# EAGLE schematic CANSniffer_v28 (EAGLE 9.7.0)
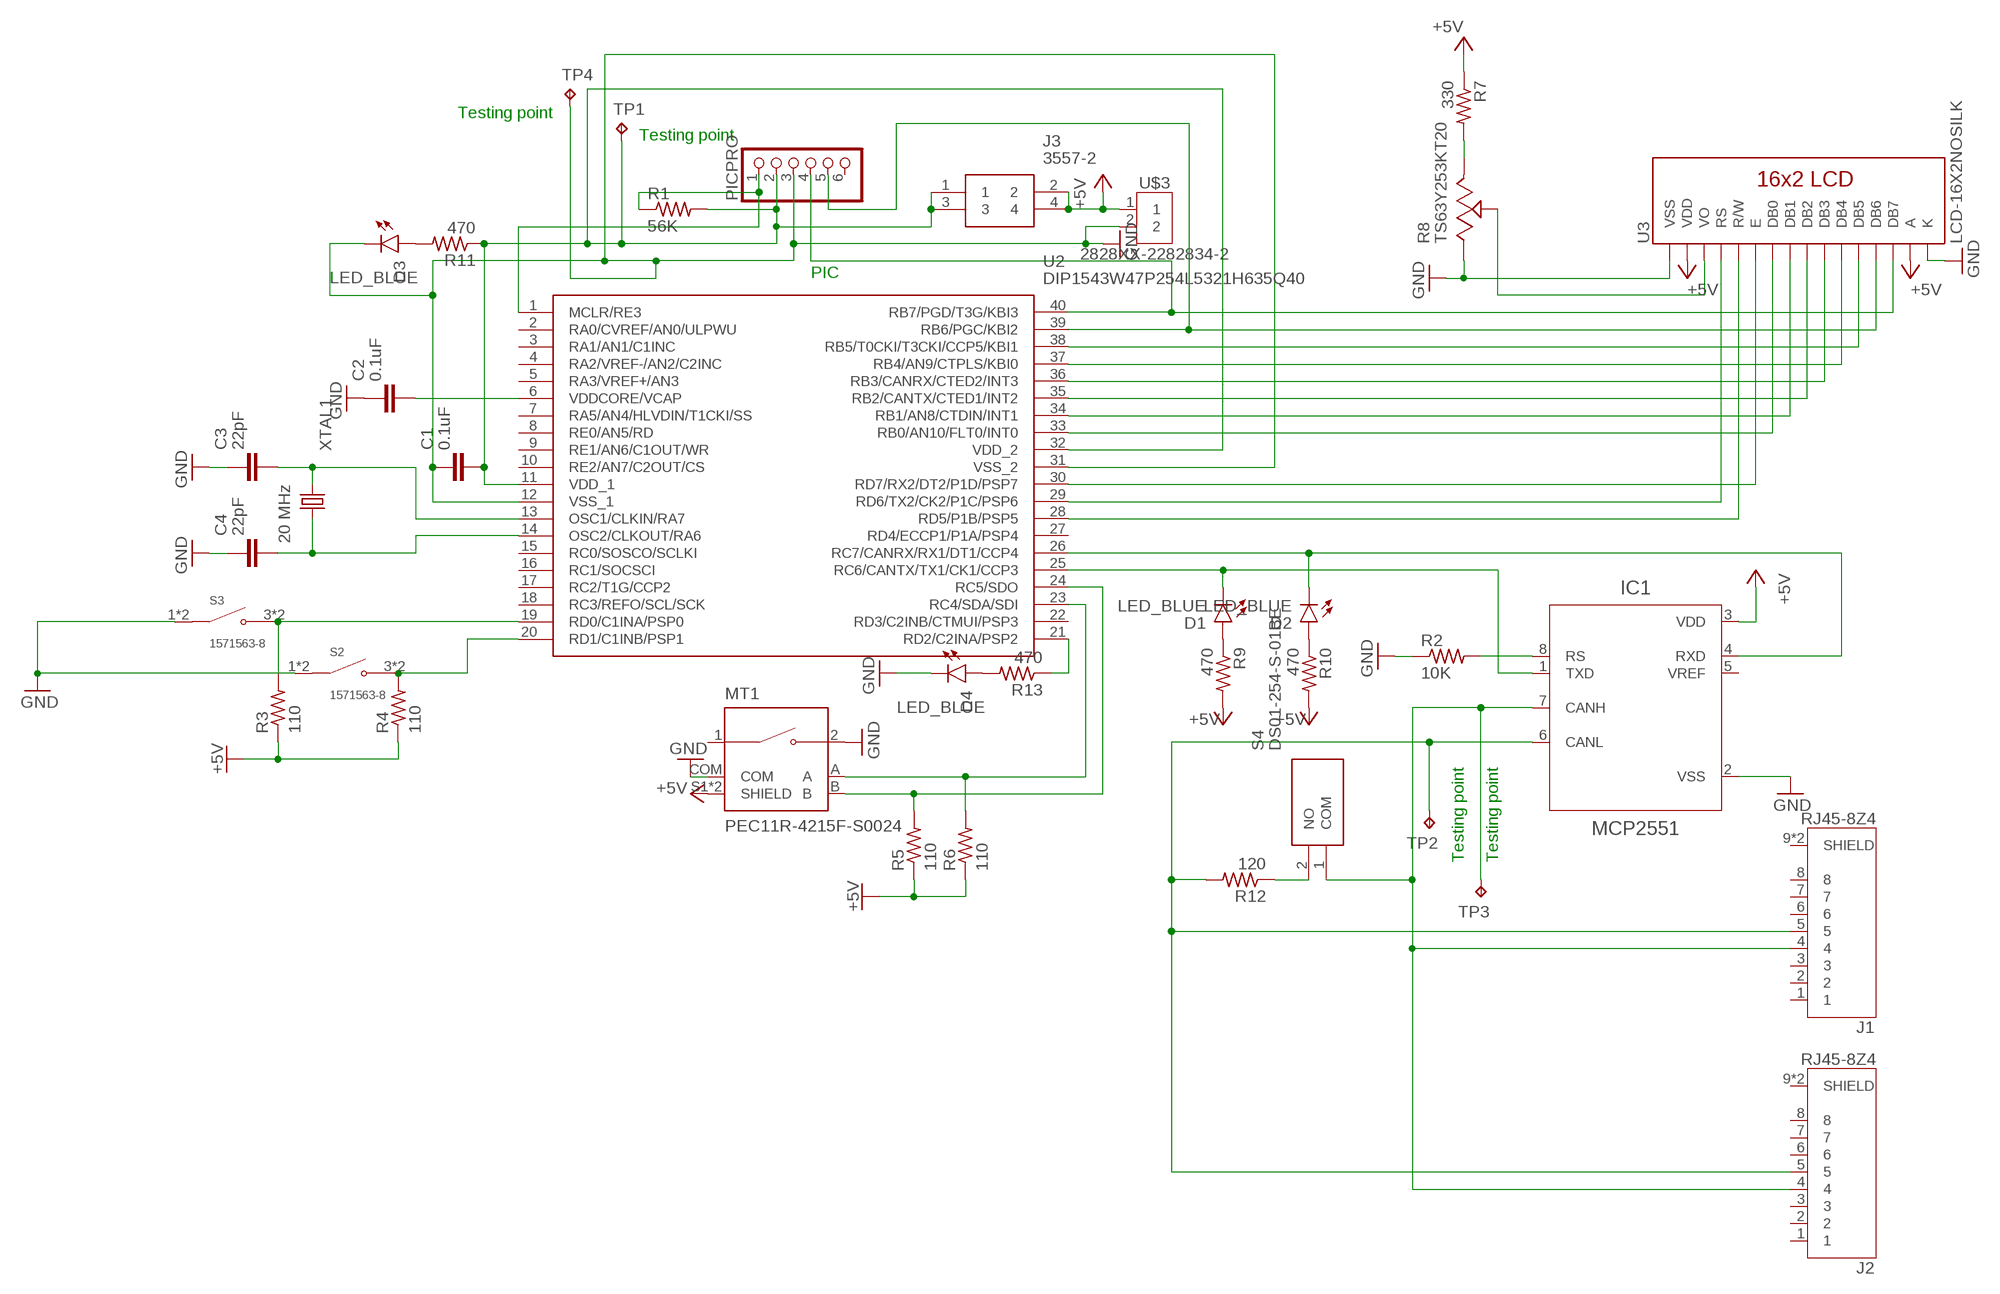
[diagram p0: schematic, sheet 1]

## Parts
C1  0.1uF  C_CHIP-1206(3216-METRIC)  [CAPC3216X135]
C2  0.1uF  C_CHIP-1206(3216-METRIC)  [CAPC3216X135]
C3  22pF  C_CHIP-1206(3216-METRIC)  [CAPC3216X135]
C4  22pF  C_CHIP-1206(3216-METRIC)  [CAPC3216X135]
D1  LED_BLUE  CHIP-FLAT-B_0402  [LEDC1005X25N_FLAT-B]
D2  LED_BLUE  CHIP-FLAT-B_0402  [LEDC1005X25N_FLAT-B]
D3  LED_BLUE  CHIP-FLAT-B_0402  [LEDC1005X25N_FLAT-B]
D4  LED_BLUE  CHIP-FLAT-B_0402  [LEDC1005X25N_FLAT-B]
IC1  MCP2551  MCP2551-I/SN_PDIP  [DIP1092W55P254L949H533Q8B]
J1  RJ45-8Z4  [TE_RJ45-8Z4]
J2  RJ45-8Z4  [TE_RJ45-8Z4]
J3  3557-2  [3557-2]
MT1  PEC11R-4215F-S0024  [XDCR_PEC11R-4215F-S0024]
PICPRO  PINHD-1X6  [1X06]
R1  56K  R-US_R0603  [R0603]
R2  10K  R-US_R0603  [R0603]
R3  110  R-US_R0603  [R0603]
R4  110  R-US_R0603  [R0603]
R5  110  R-US_R0603  [R0603]
R6  110  R-US_R0603  [R0603]
R7  330  R-US_R0603  [R0603]
R8  TS63Y253KT20  [TRIM_TS63Y253KT20]
R9  470  R-US_R0603  [R0603]
R10  470  R-US_R0603  [R0603]
R11  470  R-US_R0603  [R0603]
R12  120  R-US_R0603  [R0603]
R13  470  R-US_R0603  [R0603]
S2  1571563-8  [SW_1571563-8]
S3  1571563-8  [SW_1571563-8]
S4  DS01-254-S-01BE  [DS01254S01BE]
TP1  TPTP16R  [TP16R]
TP2  TPTP16R  [TP16R]
TP3  TPTP16R  [TP16R]
TP4  TPTP16R  [TP16R]
U2  DIP1543W47P254L5321H635Q40  [DIP1543W47P254L5321H635Q40]
U3  LCD-16X2NOSILK  [LCD-16X2_NOSILK]
U$3  2828XX-2282834-2  [TERMBLK_254-2N]
XTAL1  20 MHz  CRYSTAL_HC49-11.5L  [XTALRR488W45L1150T500H350B]

## Nets
+5V: IC1.3(VDD) J3.2 J3.4 MT1.S1(SHIELD) MT1.S2(SHIELD) R3.1 R4.1 R5.1 R6.1 R7.1 R9.2 R10.2 U3.2(VDD) U3.15(A) U$3.1
GND [12V]: C1.1 C2.1 C3.1 C4.1 D3.C D4.C IC1.2(VSS) MT1.2 MT1.COM PICPRO.3 R2.1 S2.1(COM) S2.2(COM) S3.1(COM) S3.2(COM) TP4.TP U2.12(VSS_1) U2.31(VSS_2) U3.16(K) U$3.2
N$1: PICPRO.1 R1.1 U2.1(MCLR/RE3)
N$2: U2.33(RB0/AN10/FLT0/INT0) U3.7(DB0)
N$3: IC1.8(RS) R2.2
N$4: D1.C IC1.1(TXD) U2.25(RC6/CANTX/TX1/CK1/CCP3)
N$5: PICPRO.4 U2.40(RB7/PGD/T3G/KBI3) U3.14(DB7)
N$6: PICPRO.5 U2.39(RB6/PGC/KBI2) U3.13(DB6)
N$7: U2.34(RB1/AN8/CTDIN/INT1) U3.8(DB1)
N$8: U2.35(RB2/CANTX/CTED1/INT2) U3.9(DB2)
N$9: D2.C IC1.4(RXD) U2.26(RC7/CANRX/RX1/DT1/CCP4)
N$10: C3.2 U2.13(OSC1/CLKIN/RA7) XTAL1.1
N$11: C4.2 U2.14(OSC2/CLKOUT/RA6) XTAL1.2
N$12: IC1.6(CANL) J1.5 J2.5 R12.2 TP2.TP
N$13: IC1.7(CANH) J1.4 J2.4 S4.1(COM) TP3.TP
N$14: U2.36(RB3/CANRX/CTED2/INT3) U3.10(DB3)
N$15: U2.37(RB4/AN9/CTPLS/KBI0) U3.11(DB4)
N$16: U2.38(RB5/T0CKI/T3CKI/CCP5/KBI1) U3.12(DB5)
N$17: U2.28(RD5/P1B/PSP5) U3.5(R/W)
N$18: U2.29(RD6/TX2/CK2/P1C/PSP6) U3.4(RS)
N$19: U2.30(RD7/RX2/DT2/P1D/PSP7) U3.6(E)
N$20: D2.A R10.1
N$21: R7.2 R8.3(C)
N$22: R3.2 S3.3(NO) S3.4(NO) U2.19(RD0/C1INA/PSP0)
N$23: R4.2 S2.3(NO) S2.4(NO) U2.20(RD1/C1INB/PSP1)
N$24: C2.2 U2.6(VDDCORE/VCAP)
N$25: MT1.A R6.2 U2.23(RC4/SDA/SDI)
N$26: MT1.B R5.2 U2.24(RC5/SDO)
N$27: R8.2(B) U3.3(VO)
N$28: D1.A R9.1
N$29: R12.1 S4.2(NO)
N$30: C1.2 J3.1 J3.3 PICPRO.2 R1.2 R11.1 TP1.TP U2.11(VDD_1) U2.32(VDD_2)
N$31 [12V]: R8.1(A) U3.1(VSS) ; supply symbol labelled GND
N$32: D3.A R11.2
N$33: D4.A R13.2
N$34: R13.1 U2.21(RD2/C2INA/PSP2)
Unconnected: IC1.5(VREF) J1.1 J1.2 J1.3 J1.6 J1.7 J1.8 J1.9(SHIELD) J1.10(SHIELD) J2.1 J2.2 J2.3 J2.6 J2.7 J2.8 J2.9(SHIELD) J2.10(SHIELD) MT1.1 PICPRO.6 U2.2(RA0/CVREF/AN0/ULPWU) U2.3(RA1/AN1/C1INC) U2.4(RA2/VREF-/AN2/C2INC) U2.5(RA3/VREF+/AN3) U2.7(RA5/AN4/HLVDIN/T1CKI/SS) U2.8(RE0/AN5/RD) U2.9(RE1/AN6/C1OUT/WR) U2.10(RE2/AN7/C2OUT/CS) U2.15(RC0/SOSCO/SCLKI) U2.16(RC1/SOCSCI) U2.17(RC2/T1G/CCP2) U2.18(RC3/REFO/SCL/SCK) U2.22(RD3/C2INB/CTMUI/PSP3) U2.27(RD4/ECCP1/P1A/PSP4)

## Notes on the sheet
- Testing point
- Testing point
- PIC
- Testing point | Testing point

## Library data of the parts
C1-C4 = Capacitor:C: Capacitor - Generic; CATEGORY: Capacitor
D1-D4 = LED:CHIP-FLAT-B; CATEGORY: LED; COLOR: BLUE; DESCRIPTION: CHIP LED FLAT; SUB-CATEGORY: CHIP; TYPE: FLAT_TOP
IC1 = IC_Interface:MCP2551-I/SN: High - Speed CAN Transceiver Datasheet <http://ww1.microchip.com/downloads/en/devicedoc/20001667g.pdf>; CATEGORY: RF_Wireless; MANUFACTURER: Microchip; MPN: MCP2551-I/SN; OPERATING_TEMP: -40 to +85 °C; PART_STATUS: Active; ROHS_COMPLIANT: RoHS3 Compliant; SUB-CATEGORY: Transceiver
J1 J2 = RJ45-8Z4:RJ45-8Z4: CONN MOD JACK 8P8C R/A SHIELDED; AVAILABILITY: Good; DESCRIPTION: RJ Jack / Signal Line EMI/RFI Filters 8 TRM NO FLTR LOWPRO BRD GRND&CBL; GRND; MF: TE; MP: RJ45-8Z4; PACKAGE: None; PRICE: 4.35 USD; STANDARD: Manufacturer Recommendation
J3 = 3557-2:3557-2: THM 2 in 1 Auto Blade Holder P/N 3557-2 Source: Datasheet <http://www.keyelco.com/product-pdf.cfm?p=296>; DESCRIPTION: THM 2 in 1 Auto Blade Holder P/N 3557-2; HEIGHT: mm; MANUFACTURER_NAME: Keystone Electronics; MANUFACTURER_PART_NUMBER: 3557-2; MOUSER_PART_NUMBER: 534-3557-2; MOUSER_PRICE-STOCK: https://www.mouser.co.uk/ProductDetail/Keystone-Electronics/3557-2?qs=cxy41lVAGV%2FfbyASjpXK1g%3D%3D
MT1 = PEC11R-4215F-S0024 (1):PEC11R-4215F-S0024: Incremental Encoder, 12 Mm, Contact Rating 10 Ma - 5 Vdc; MANUFACTURER: J.W.Miller/Bourns; MAXIMUM_PACKAGE_HEIGHT: 21.5 mm; PARTREV: Rev. 09/19; STANDARD: Manufacturer Recommendations
PICPRO = adafruit:PINHD-1X6: PIN HEADER
R1-R7 R9-R13 = adafruit:R-US_: RESISTOR, American symbol
R8 = TS63Y253KT20:TS63Y253KT20; MANUFACTURER: Vishay; MAXIMUM_PACKAGE_HEIGHT: 8 mm; PARTREV: 17-Oct-2018; SNAPEDA_PN: TS63Y253KT20; STANDARD: Manufacturer Recommendations
S2 S3 = 1571563-8:1571563-8; COMMENT: 1571563-8; EU_ROHS_COMPLIANCE: Compliant
S4 = Switch:DS01-254-S-01BE: DIP Switches / SIP Switches DIP Switch, SPST, 2.54 pitch, raised actuator, flat bottom, Short pin, 1 position, Blue Source: Datasheet <https://www.mouser.in/datasheet/2/670/ds01_254-1777712.pdf>; ARROW_PART_NUMBER: DS01-254-S-01BE; ARROW_PRICE-STOCK: https://www.arrow.com/en/products/ds01-254-s-01be/cui-devices?region=nac; DESCRIPTION: DIP Switches / SIP Switches DIP Switch, SPST, 2.54 pitch, raised actuator, flat bottom, Short pin, 1 position, Blue; HEIGHT: 7mm; MANUFACTURER_NAME: CUI Inc.; MANUFACTURER_PART_NUMBER: DS01-254-S-01BE; MOUSER_PART_NUMBER: 490-DS01-254-S-01BE; MOUSER_PRICE-STOCK: https://www.mouser.co.uk/ProductDetail/CUI-Devices/DS01-254-S-01BE?qs=wnTfsH77Xs7pnks1JfJqEQ%3D%3D
TP1-TP4 = testpad:TP: Test pad
U2 = DIP1543W47P254L5321H635Q40:DIP1543W47P254L5321H635Q40; A_MAX: 6.35; A_MIN: 6.35; A_NOM: 6.35; B_MAX: 0.584; B_MIN: 0.356; B_NOM: 0.47; D_MAX: 53.213; D_MIN: 50.292; D_NOM: 51.752; E1_MAX: 14.732; E1_MIN: 12.319; E1_NOM: 13.526; ENOM: 2.54; E_NOM: 15.431; MANUFACTURER: Microchip; PIN_COUNT: 40.0; STANDARD: IPC 7351B
U3 = newLCD:LCD-16X2: Standard text-only 16x2 parallel input LCD Check availability <https://pricing.snapeda.com/parts/LCD-16X2/Gravitech/view-part?ref=eda>; AVAILABILITY: In Stock; DESCRIPTION: Display Development Tools 16x2 Black on Green Char LCD w Backlight; MF: Gravitech; MP: LCD-16X2; PACKAGE: None; PRICE: None; PURCHASE-URL: https://pricing.snapeda.com/search/part/LCD-16X2/?ref=eda
U$3 = Connector:2828XX-2: 2 Position Wire to Board Terminal Block Horizontal with Board Datasheet <https://www.te.com.cn/commerce/DocumentDelivery/DDEController?Action=showdoc&DocId=Catalog+Section%7F1308389_EUROSTYLE_TERMINAL_BLOCKS%7F0607%7Fpdf%7FEnglish%7FENG_CS_1308389_EUROSTYLE_TERMINAL_BLOCKS_0607.pdf%7F2-282837-5>
XTAL1 = Frequency-Source:CRYSTAL: Crystal 2Pin - Generic; CATEGORY: Frequency-Source; SUB-CATEGORY: Crystal-2Pin; VALUE: HC49

## Net classes
2 12V: width 0.635 mm
3 GND: width 0.635 mm